# EAGLE design hv507_connector (EAGLE 7.1.0)
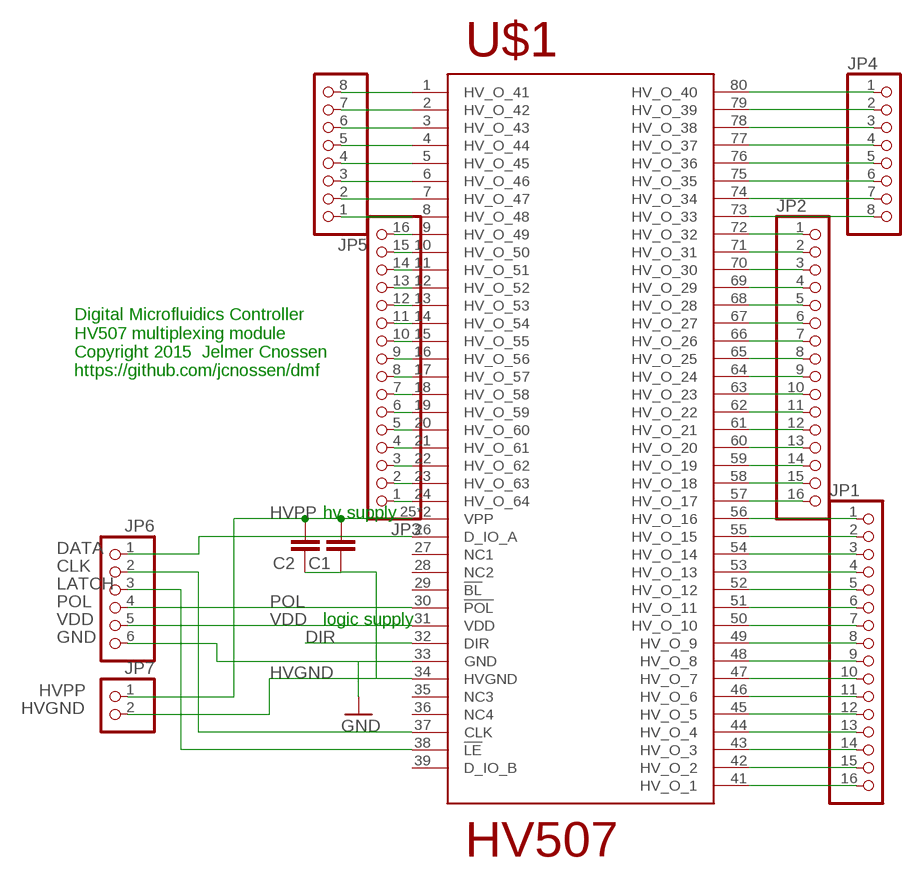
[diagram p0: schematic, sheet 1]

## Parts
C1  C-EUC1812  [C1812]
C2  C-EUC1206  [C1206]
JP1  PINHD-1X16_2.54-S  [1X16-S]
JP2  PINHD-1X16_2.54-S  [1X16-S]
JP3  PINHD-1X16_2.54-S  [1X16-S]
JP4  PINHD-1X08_2.54-S  [1X08-S]
JP5  PINHD-1X08_2.54-S  [1X08-S]
JP6  PINHD-1X06_2.54-S  [1X06-S]
JP7  PINHD-1X02_2.54-S  [1X02-S]
U$1  HV507  [HV507PG-G]

## Nets
1: JP1.16 U$1.41(HV_O_1)
16: JP1.1 U$1.56(HV_O_16)
17: JP2.16 U$1.57(HV_O_17)
32: JP2.1 U$1.72(HV_O_32)
33: JP4.8 U$1.73(HV_O_33)
40: JP4.1 U$1.80(HV_O_40)
41: JP5.8 U$1.1(HV_O_41)
48: JP5.1 U$1.8(HV_O_48)
49: JP3.16 U$1.9(HV_O_49)
64: JP3.1 U$1.24(HV_O_64)
CLK: JP6.2 U$1.37(CLK)
DATA: JP6.1 U$1.26(D_IO_A)
DIR: U$1.32(DIR)
GND: JP6.6 U$1.33(GND)
HVGND: C1.1 C2.1 JP7.2 U$1.34(HVGND)
HVPP: C1.2 C2.2 JP7.1 U$1.25(VPP) U$1.40(VPP)
LATCH: JP6.3 U$1.38(!LE)
N$2: JP1.2 U$1.55(HV_O_15)
N$3: JP1.3 U$1.54(HV_O_14)
N$4: JP1.4 U$1.53(HV_O_13)
N$5: JP1.5 U$1.52(HV_O_12)
N$6: JP1.6 U$1.51(HV_O_11)
N$7: JP1.7 U$1.50(HV_O_10)
N$8: JP1.8 U$1.49(HV_O_9)
N$9: JP1.9 U$1.48(HV_O_8)
N$10: JP1.10 U$1.47(HV_O_7)
N$11: JP1.11 U$1.46(HV_O_6)
N$12: JP1.12 U$1.45(HV_O_5)
N$13: JP1.13 U$1.44(HV_O_4)
N$14: JP1.14 U$1.43(HV_O_3)
N$15: JP1.15 U$1.42(HV_O_2)
N$18: JP2.2 U$1.71(HV_O_31)
N$19: JP2.3 U$1.70(HV_O_30)
N$20: JP2.4 U$1.69(HV_O_29)
N$21: JP2.5 U$1.68(HV_O_28)
N$22: JP2.6 U$1.67(HV_O_27)
N$23: JP2.7 U$1.66(HV_O_26)
N$24: JP2.8 U$1.65(HV_O_25)
N$25: JP2.9 U$1.64(HV_O_24)
N$26: JP2.10 U$1.63(HV_O_23)
N$27: JP2.11 U$1.62(HV_O_22)
N$28: JP2.12 U$1.61(HV_O_21)
N$29: JP2.13 U$1.60(HV_O_20)
N$30: JP2.14 U$1.59(HV_O_19)
N$31: JP2.15 U$1.58(HV_O_18)
N$34: JP3.2 U$1.23(HV_O_63)
N$35: JP3.3 U$1.22(HV_O_62)
N$36: JP3.4 U$1.21(HV_O_61)
N$37: JP3.5 U$1.20(HV_O_60)
N$38: JP3.6 U$1.19(HV_O_59)
N$39: JP3.7 U$1.18(HV_O_58)
N$40: JP3.8 U$1.17(HV_O_57)
N$41: JP3.9 U$1.16(HV_O_56)
N$42: JP3.10 U$1.15(HV_O_55)
N$43: JP3.11 U$1.14(HV_O_54)
N$44: JP3.12 U$1.13(HV_O_53)
N$45: JP3.13 U$1.12(HV_O_52)
N$46: JP3.14 U$1.11(HV_O_51)
N$47: JP3.15 U$1.10(HV_O_50)
N$50: JP4.2 U$1.79(HV_O_39)
N$51: JP4.3 U$1.78(HV_O_38)
N$52: JP4.4 U$1.77(HV_O_37)
N$53: JP4.5 U$1.76(HV_O_36)
N$54: JP4.6 U$1.75(HV_O_35)
N$55: JP4.7 U$1.74(HV_O_34)
N$58: JP5.2 U$1.7(HV_O_47)
N$59: JP5.3 U$1.6(HV_O_46)
N$60: JP5.4 U$1.5(HV_O_45)
N$61: JP5.5 U$1.4(HV_O_44)
N$62: JP5.6 U$1.3(HV_O_43)
N$63: JP5.7 U$1.2(HV_O_42)
POL: JP6.4 U$1.30(!POL)
VDD: JP6.5 U$1.31(VDD)
Unconnected: U$1.27(NC1) U$1.28(NC2) U$1.29(!BL) U$1.35(NC3) U$1.36(NC4) U$1.39(D_IO_B)

## Notes on the sheet
- Digital Microfluidics Controller
  HV507 multiplexing module
  Copyright 2015  Jelmer Cnossen  
  https://github.com/jcnossen/dmf
- hv supply
- logic supply

## Library data of the parts
C1 C2 = rcl:C-EU: CAPACITOR, European symbol
JP1-JP3 = pinhead-2:PINHD-1X16: PIN HEADER
JP4 JP5 = pinhead-2:PINHD-1X08: PIN HEADER
JP6 = pinhead-2:PINHD-1X06: PIN HEADER
JP7 = pinhead-2:PINHD-1X02: PIN HEADER
U$1 = HV507:HV507

## Board
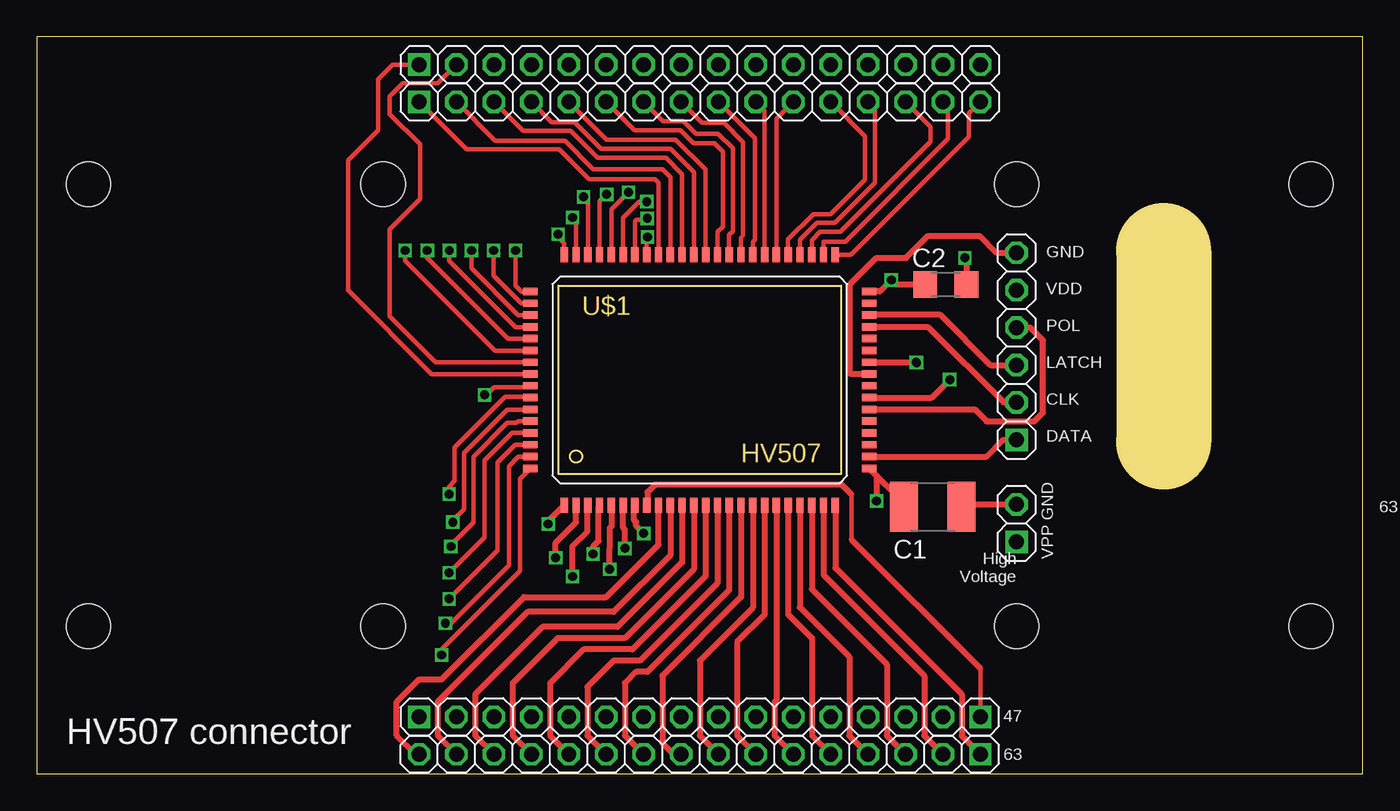
[diagram p1: board, top side]
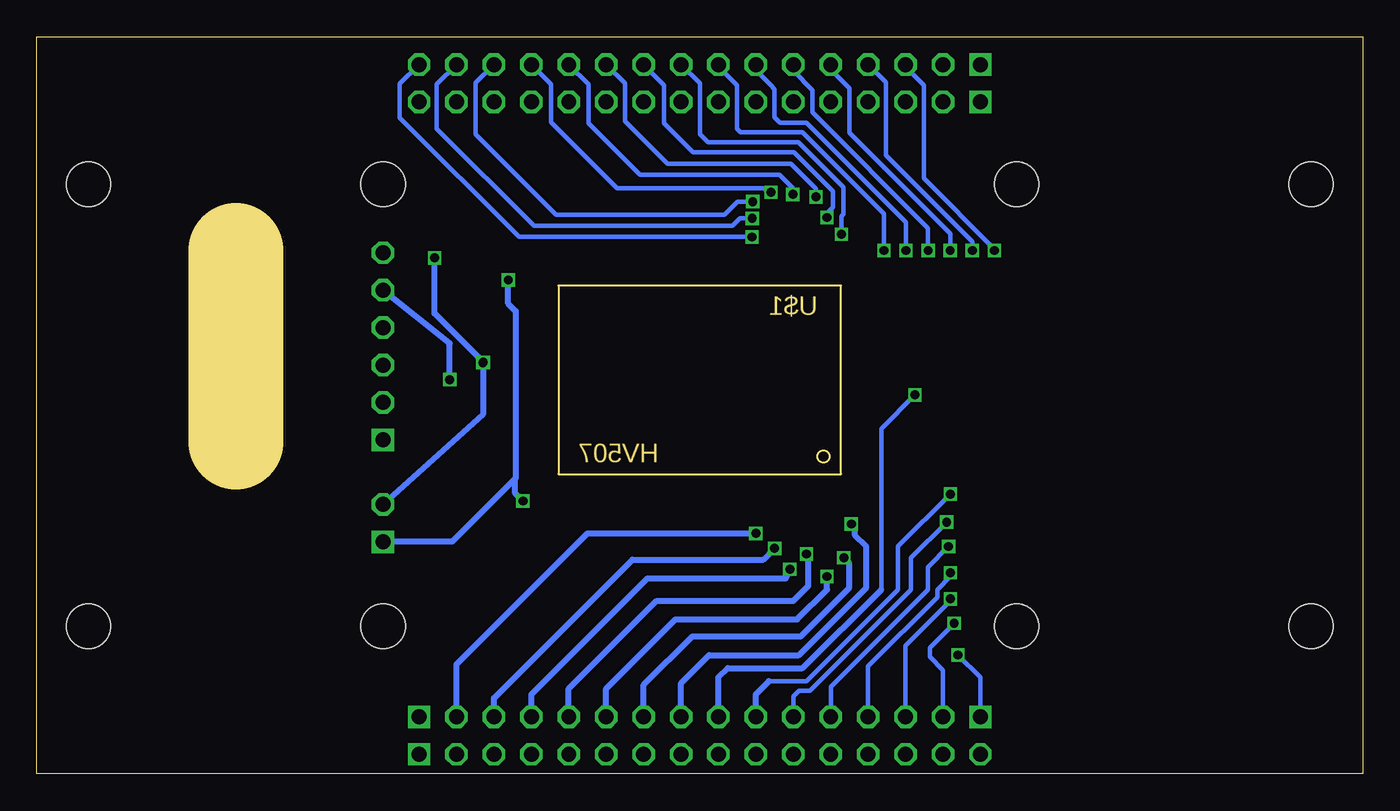
[diagram p2: board, bottom side, seen from below]

Size 90 x 50 mm. Coordinates in mm from the lower left corner, seen from the top.
Outline: 0,0 90,0 90,50 0,50 0,0
Copper layers (1*16): Top 0.035mm / dielectric 1.5mm / Bottom 0.035mm
Design rules "dirt_cheap_dirty_boards.v1": minimum track width 5mil, minimum drill 12mil, track to track 5mil, track to pad 5mil, pad to pad 5mil, via to via 5mil, smd to smd 0mil, copper to edge 10mil, drill to drill 10mil, minimum pad ring 10mil, minimum via ring 6mil, stop-mask expansion 2mil, vias tented up to drill 25mil, thermal gap 10mil
Holes 3 mm at 23.5,10 66.5,10 66.5,40 23.5,40 86.5,40 86.5,10 3.5,10 3.5,40
Milling: 1 lines

### Footprints (pad centres in the part's own frame; a part is rotated, then mirrored left to right if it is on the bottom)
C1812 = smd 1.9 x 3.4: 1 -1.95,0; 2 1.95,0
C1206 = smd 1.6 x 1.8: 1 -1.4,0; 2 1.4,0
1X16-S = drill 1.016 square: 1 -19.05,0 | drill 1.016 octagon: 2 -16.51,0; 3 -13.97,0; 4 -11.43,0; 5 -8.89,0; 6 -6.35,0; 7 -3.81,0; 8 -1.27,0; 9 1.27,0; 10 3.81,0; 11 6.35,0; 12 8.89,0; 13 11.43,0; 14 13.97,0; 15 16.51,0; 16 19.05,0
1X08-S = drill 1.016 square: 1 -8.89,0 | drill 1.016 octagon: 2 -6.35,0; 3 -3.81,0; 4 -1.27,0; 5 1.27,0; 6 3.81,0; 7 6.35,0; 8 8.89,0
1X06-S = drill 1.016 square: 1 -6.35,0 | drill 1.016 octagon: 2 -3.81,0; 3 -1.27,0; 4 1.27,0; 5 3.81,0; 6 6.35,0
1X02-S = drill 1.016 square: 1 -1.27,0 | drill 1.016 octagon: 2 1.27,0
HV507PG-G = smd 0.5 x 1: 1 -9.2,-8.5; 2 -8.4,-8.5; 3 -7.6,-8.5; 4 -6.8,-8.5; 5 -6,-8.5; 6 -5.2,-8.5; 7 -4.4,-8.5; 8 -3.6,-8.5; 9 -2.8,-8.5; 10 -2,-8.5; 11 -1.2,-8.5; 12 -0.4,-8.5; 13 0.4,-8.5; 14 1.2,-8.5; 15 2,-8.5; 16 2.8,-8.5; 17 3.6,-8.5; 18 4.4,-8.5; 19 5.2,-8.5; 20 6,-8.5; 21 6.8,-8.5; 22 7.6,-8.5; 23 8.4,-8.5; 24 9.2,-8.5; 41 9.2,8.5; 42 8.4,8.5; 43 7.6,8.5; 44 6.8,8.5; 45 6,8.5; 46 5.2,8.5; 47 4.4,8.5; 48 3.6,8.5; 49 2.8,8.5; 50 2,8.5; 51 1.2,8.5; 52 0.4,8.5; 53 -0.4,8.5; 54 -1.2,8.5; 55 -2,8.5; 56 -2.8,8.5; 57 -3.6,8.5; 58 -4.4,8.5; 59 -5.2,8.5; 60 -6,8.5; 61 -6.8,8.5; 62 -7.6,8.5; 63 -8.4,8.5; 64 -9.2,8.5 | smd 1 x 0.5: 25 11.5,-6; 26 11.5,-5.2; 27 11.5,-4.4; 28 11.5,-3.6; 29 11.5,-2.8; 30 11.5,-2; 31 11.5,-1.2; 32 11.5,-0.4; 33 11.5,0.4; 34 11.5,1.2; 35 11.5,2; 36 11.5,2.8; 37 11.5,3.6; 38 11.5,4.4; 39 11.5,5.2; 40 11.5,6; 65 -11.5,6; 66 -11.5,5.2; 67 -11.5,4.4; 68 -11.5,3.6; 69 -11.5,2.8; 70 -11.5,2; 71 -11.5,1.2; 72 -11.5,0.4; 73 -11.5,-0.4; 74 -11.5,-1.2; 75 -11.5,-2; 76 -11.5,-2.8; 77 -11.5,-3.6; 78 -11.5,-4.4; 79 -11.5,-5.2; 80 -11.5,-6

### Placement (x,y rotation side)
C1  60.8,18.1 180 top
C2  61.7,33.2 180 top
JP1  45,45.58 0 top
JP2  45,48.12 0 top
JP3  45,1.32 180 top
JP4  34.84,3.86 0 top
JP5  55.16,3.86 180 top
JP6  66.5,29 90 top
JP7  66.5,17 90 top
U$1  45,26.72 0 top

### Tracks (layer width: path | path; a pad name or v marks a point on that pad's centre or on a via)
1
  Top 0.305: U$1.41 55.27,35.22 63.28,43.23 63.28,44.81 JP1.16
16
  Top 0.305: U$1.56 42.2,40.11 41.98,40.33 37.48,40.33 35.45,42.36 29.17,42.36 JP1.1
17  (via drill 0.6)
  Top 0.305: U$1.57 41.4,36.37 v41.45,36.42
  Bottom 0.305: v41.45,36.42 57.27,36.42 65.36,44.51 65.36,46.81 JP2.16
32
  Top 0.305: JP2.1 24.16,48.12 23.17,47.13 23.17,43.66 21.12,41.61 21.12,32.8 26.81,27.11 U$1.72
33  (via drill 0.6)
  Top 0.305: v30.39,25.7 30.52,25.7 31.03,26.21 33.39,26.21 U$1.73
  Bottom 0.305: 32.68,12.5 32.68,23.42 v30.39,25.7
  Bottom 0.406: JP4.8 43.73,6.53 43.09,7.16 38.02,7.16 32.68,12.5
40  (via drill 0.6)
  Top 0.305: v27.47,8.05 27.47,8.43 32.81,13.77 32.81,20.03 U$1.80
  Bottom 0.305: JP4.1 25.95,6.53 v27.47,8.05
41  (via drill 0.6)
  Top 0.406: v34.71,16.94 34.71,17.13 U$1.1
  Bottom 0.406: JP5.8 46.27,6.15 44.36,8.05 38.27,8.05 33.7,12.62 33.7,15.42 34.46,16.18 34.46,16.69 v34.71,16.94
48
  Top 0.305: JP5.1 64.05,7.14 | 55.3,15.89 55.3,18.96 55.27,19
  Top 0.406: 55.27,19 54.65,19.61 41.95,19.61 41.44,19.1 41.44,18.26 U$1.8 | 55.3,15.89 64.05,7.14
49
  Top 0.406: JP3.16 25.7,1.32 24.43,2.59 24.43,4.88 25.95,6.4 27.47,6.4 33.06,11.99 38.65,11.99 42.21,15.54 U$1.9
64
  Top 0.406: U$1.24 54.2,13.96 62.78,5.38 62.78,2.59 JP3.1
CLK
  Top 0.406: U$1.37 56.53,30.29 60.53,30.29 65.63,25.19 JP6.2
DATA
  Top 0.406: U$1.26 64.45,21.52 65.58,22.65 JP6.1
GND
  Top 0.406: U$1.33 55.27,27.12 55.21,27.18 55.21,33.2 57.01,35 59,35 60.5,36.5 64,36.5 65.15,35.35 JP6.6
HVGND  (via drill 0.6)
  Top 0.406: U$1.34 v59.69,27.92 v59.72,27.89 | C1.1 62.92,18.27 JP7.2 | v63,35 63.1,34.9 C2.1
  Bottom 0.406: v59.72,27.89 59.72,24.37 JP7.2 | v59.69,27.92 63,31.23 v63,35
HVPP  (via drill 0.6)
  Top 0.406: C1.2 58.85,18.37 U$1.25 57,20.22 v57,18.5 | U$1.40 57.22,32.72 v58,33.5 58.3,33.2 C2.2
  Bottom 0.406: 57.52,20.02 57.49,20.06 57.49,31.39 58,31.9 v58,33.5 | 57.52,20.02 61.8,15.75 65.8,15.75 JP7.1 | v57,18.5 57.52,19.02 57.52,20.02
LATCH
  Top 0.406: U$1.38 61.34,31.13 64.74,27.73 JP6.3
N$2
  Top 0.305: U$1.55 43,40.48 42.46,41.02 37.77,41.02 35.84,42.95 31.12,42.95 JP1.2
N$3
  Top 0.305: U$1.54 43.8,40.68 42.7,41.78 38.07,41.78 36.23,43.62 32.99,43.62 JP1.3
N$4
  Top 0.305: U$1.53 44.6,40.82 43.02,42.4 38.31,42.4 36.49,44.22 34.93,44.22 JP1.4
N$5
  Top 0.305: U$1.52 45.4,41 43.37,43.03 38.66,43.03 JP1.5
N$6
  Top 0.305: U$1.51 46.2,36.76 46.57,37.13 46.57,42.21 46.01,42.77 44.58,42.77 43.69,43.66 40.57,43.66 JP1.6
N$7
  Top 0.305: U$1.50 47,36.56 47.24,36.8 47.24,42.44 46.24,43.44 44.74,43.44 43.91,44.27 42.5,44.27 JP1.7
N$8
  Top 0.305: U$1.49 47.8,36.37 47.95,36.52 47.95,42.86 46.65,44.16 45.15,44.16 JP1.8
N$9
  Top 0.305: U$1.48 48.6,36.1 48.74,36.24 48.74,43.11 JP1.9
N$10
  Top 0.305: U$1.47 49.4,44.99 JP1.10
N$11
  Top 0.305: U$1.46 50.2,44.43 JP1.11
N$12
  Top 0.305: U$1.45 51,36.26 52.71,37.97 53.88,37.97 56.21,40.3 56.21,43.26 JP1.12
N$13
  Top 0.305: U$1.44 51.8,36.22 52.96,37.38 54.19,37.38 56.9,40.09 56.9,45.11 JP1.13
N$14
  Top 0.305: U$1.43 52.6,36.2 53.17,36.77 54.55,36.77 60.66,42.88 60.66,43.89 JP1.14
N$15
  Top 0.305: U$1.42 53.4,36.1 53.39,36.11 54.89,36.11 61.86,43.08 61.86,45.23 JP1.15
N$18
  Top 0.305: U$1.71 27.06,27.92 23.95,31.03 23.95,36.95 26,39 26,42.71 23.96,44.75 23.96,45.96 23.95,45.97 24.83,46.85 27.22,46.85 JP2.2
N$19  (via drill 0.6)
  Top 0.305: v25,35.5 25,34.8 31.1,28.7 33.48,28.7 U$1.70
  Bottom 0.305: JP2.3 31.03,47.96 29.79,46.72 29.8,46.71 29.8,40.4 25,35.6 v25,35.5
N$20  (via drill 0.6)
  Top 0.305: v26.5,35.5 26.47,35.47 26.47,35.03 32,29.5 33.48,29.5 U$1.69
  Bottom 0.305: JP2.4 32.36,46.91 32.36,41.96 26.5,36.1 v26.5,35.5
N$21  (via drill 0.6)
  Top 0.305: U$1.68 32.49,30.31 28,34.8 v28,35.5
  Bottom 0.305: JP2.5 36.11,47.78 34.85,46.52 34.85,43.49 32.51,41.15 | 32.51,41.15 32.51,41.13 | v28,35.5 28,36.64 32.51,41.15
N$22  (via drill 0.6)
  Top 0.305: U$1.67 32.68,31.12 29.5,34.3 v29.5,35.5
  Bottom 0.305: JP2.6 38.65,47.69 37.35,46.39 37.35,44.87 29.5,37.02 v29.5,35.5
N$23  (via drill 0.6)
  Top 0.305: U$1.66 32.88,31.92 31,33.8 v31,35.5
  Bottom 0.305: JP2.7 41.19,47.74 40.06,46.61 40.06,46.59 39.93,46.46 39.93,44.55 39.55,44.17 37.75,44.17 31,37.42 v31,35.5
N$24  (via drill 0.6)
  Top 0.305: v32.5,35.5 32.5,33.1 32.9,32.7 33.48,32.7 U$1.65
  Bottom 0.305: JP2.8 43.73,47.98 42.46,46.71 42.46,43.77 42.22,43.53 38.04,43.53 32.5,37.99 v32.5,35.5
N$25  (via drill 0.6)
  Top 0.305: U$1.64 35.8,36 35.43,36.37 35.43,36.56 v35.38,36.61
  Bottom 0.305: v35.38,36.61 35.38,37.84 35.25,37.97 35.25,39.79 38.3,42.84 44.43,42.84 44.99,43.4 44.99,46.84 JP2.9
N$26  (via drill 0.6)
  Top 0.305: U$1.63 36.6,37.5 v36.36,37.74
  Bottom 0.305: v36.36,37.74 36.36,38.02 35.95,38.43 35.95,39.52 38.6,42.17 45.46,42.17 47.42,44.13 47.42,46.73 JP2.10
N$27  (via drill 0.6)
  Top 0.305: U$1.62 37.4,38.85 v37.11,39.14
  Bottom 0.305: v37.11,39.14 37.11,39.68 38.82,41.39 47.2,41.39 50.07,44.26 50.07,46.84 JP2.11
N$28  (via drill 0.6)
  Top 0.305: U$1.61 38.2,38.83 v38.68,39.31
  Bottom 0.305: v38.68,39.31 38.68,39.72 39.6,40.64 49.07,40.64 52.56,44.13 52.56,46.79 JP2.12
N$29  (via drill 0.6)
  Top 0.305: U$1.60 39,38.29 v40.16,39.45
  Bottom 0.305: v40.16,39.45 40.36,39.45 40.65,39.74 50.63,39.74 55.11,44.22 55.11,46.8 JP2.13
N$30  (via drill 0.6)
  Top 0.305: U$1.59 39.8,37.72 40.89,38.81 v41.39,38.81 v41.4,38.82
  Bottom 0.305: v41.4,38.82 42.44,38.82 43.32,37.94 54.77,37.94 60.21,43.38 60.21,46.88 JP2.14
N$31  (via drill 0.6)
  Top 0.305: U$1.58 40.6,37.49 40.71,37.6 41.36,37.6 v41.44,37.68
  Bottom 0.305: v41.44,37.68 42.27,37.68 42.78,37.17 56.26,37.17 62.86,43.77 62.86,46.77 JP2.15
N$34
  Top 0.406: U$1.23 53.4,13.49 60.24,6.65 60.24,2.59 JP3.2
N$35
  Top 0.406: U$1.22 52.6,12.52 57.7,7.42 57.7,2.59 JP3.3
N$36
  Top 0.406: U$1.21 51.8,11.28 55.16,7.92 55.16,2.59 JP3.4
N$37
  Top 0.406: U$1.20 51,10.81 52.62,9.19 52.62,2.59 JP3.5
N$38
  Top 0.406: U$1.19 50.2,5 50.08,4.88 50.08,2.59 JP3.6
N$39
  Top 0.406: U$1.18 49.4,10.8 47.54,8.94 47.54,2.59 JP3.7
N$40
  Top 0.406: U$1.17 48.6,11.27 45,7.67 45,2.59 JP3.8
N$41
  Top 0.406: U$1.16 47.8,11.99 42.46,6.65 42.46,2.08 43.22,1.32 JP3.9
N$42
  Top 0.406: U$1.15 47,12.46 41.44,6.91 40.68,6.91 39.92,6.15 39.92,2.59 JP3.10
N$43
  Top 0.406: U$1.14 46.2,12.93 40.94,7.67 39.16,7.67 37.38,5.89 37.38,2.59 JP3.11
N$44
  Top 0.406: U$1.13 45.4,13.4 40.43,8.43 37.13,8.43 34.84,6.15 34.84,2.59 JP3.12
N$45
  Top 0.406: U$1.12 44.6,13.87 39.92,9.19 35.35,9.19 32.3,6.15 32.3,2.59 JP3.13
N$46
  Top 0.406: U$1.11 43.8,14.34 39.41,9.96 34.33,9.96 29.76,5.38 29.76,2.59 JP3.14
N$47
  Top 0.406: U$1.10 43,14.81 39.16,10.97 33.32,10.97 27.22,4.88 27.22,2.59 JP3.15
N$50  (via drill 0.6)
  Top 0.305: v27.73,10.21 28.11,10.21 32.05,14.15 32.05,20.88 32.68,21.51 U$1.79
  Bottom 0.305: JP4.2 28.49,7.04 29.38,7.92 29.38,8.56 v27.73,10.21
N$51  (via drill 0.6)
  Top 0.305: U$1.78 32.47,22.32 31.28,21.13 31.28,15.16 v27.98,11.86
  Bottom 0.305: JP4.3 31.03,8.69 27.98,11.73 v27.98,11.86
N$52  (via drill 0.6)
  Top 0.305: U$1.77 32.26,23.12 30.39,21.26 30.39,16.05 v27.98,13.64
  Bottom 0.305: JP4.4 33.57,7.29 28.87,11.99 28.87,12.5 27.98,13.38 v27.98,13.64
N$53  (via drill 0.6)
  Top 0.305: v28.11,15.42 28.11,15.54 29.63,17.07 29.63,21.51 31.92,23.8 32.55,23.8 32.68,23.93 U$1.76
  Bottom 0.305: JP4.5 36.11,5.89 29.51,12.5 29.51,14.02 v28.11,15.42
N$54  (via drill 0.6)
  Top 0.305: U$1.75 33.47,24.69 31.92,24.69 29,21.77 29,17.96 28.24,17.2 v28.24,17.07
  Bottom 0.305: JP4.6 38.65,5.26 38.27,5.64 37.51,5.64 30.65,12.5 30.65,14.65 v28.24,17.07
N$55  (via drill 0.6)
  Top 0.305: v27.98,18.97 27.98,19.48 28.36,19.86 28.36,22.15 31.79,25.58 33.44,25.58 U$1.74
  Bottom 0.305: 40.3,6.27 37.76,6.27 31.54,12.5 31.54,15.42 v27.98,18.97
  Bottom 0.406: JP4.7 41.19,5.38 40.3,6.27
N$58  (via drill 0.6)
  Top 0.406: v41.19,16.31 40.68,16.81 40.68,17.07 40.55,17.2 40.55,18.18 U$1.7
  Bottom 0.406: JP5.2 61.51,7.42 52.62,16.31 v41.19,16.31
N$59  (via drill 0.6)
  Top 0.406: v39.92,15.29 39.92,16.56 39.79,16.69 U$1.6
  Bottom 0.406: JP5.3 58.97,5.13 49.57,14.53 40.68,14.53 v39.92,15.29
N$60  (via drill 0.6)
  Top 0.406: v38.88,13.87 38.9,16.69 39.03,16.81 39.03,18.19 U$1.5
  Bottom 0.406: JP5.4 56.43,5.38 48.56,13.26 39.16,13.26 v38.88,13.87
N$61  (via drill 0.6)
  Top 0.406: v37.76,14.91 37.76,15.42 38.14,15.8 38.14,18.16 U$1.4
  Bottom 0.406: JP5.5 53.89,5.76 47.92,11.73 38.65,11.73 37.63,12.75 37.63,14.78 v37.76,14.91
N$62  (via drill 0.6)
  Top 0.406: v36.36,13.38 36.36,15.42 37.38,16.43 37.38,18.2 U$1.3
  Bottom 0.406: JP5.6 51.35,5.76 46.65,10.46 38.4,10.46 36.36,12.5 v36.36,13.38
N$63  (via drill 0.6)
  Top 0.406: v35.22,14.65 35.22,15.67 36.62,17.07 36.62,18.2 U$1.2
  Bottom 0.406: JP5.7 48.81,6.02 45.51,9.32 38.14,9.32 34.84,12.62 34.84,14.27 v35.22,14.65
POL
  Top 0.406: U$1.30 63.67,24.72 64.49,23.9 67.7,23.9 68.3,24.5 68.3,29.4 67.43,30.27 JP6.4
VDD  (via drill 0.6)
  Top 0.406: U$1.31 60.75,25.52 v61.97,26.74
  Bottom 0.406: v61.97,26.74 61.97,29.2 JP6.5

### Text on the board
tPlace: 63 | 63 | GND | VDD | POL | LATCH | CLK | DATA | GND | 63 | VPP | High / Voltage | 47 | HV507 connector | 63